# Altium schematic sheet Sheet1.SchDoc
size A4; SheetNumber: 1; SheetTotal: 1
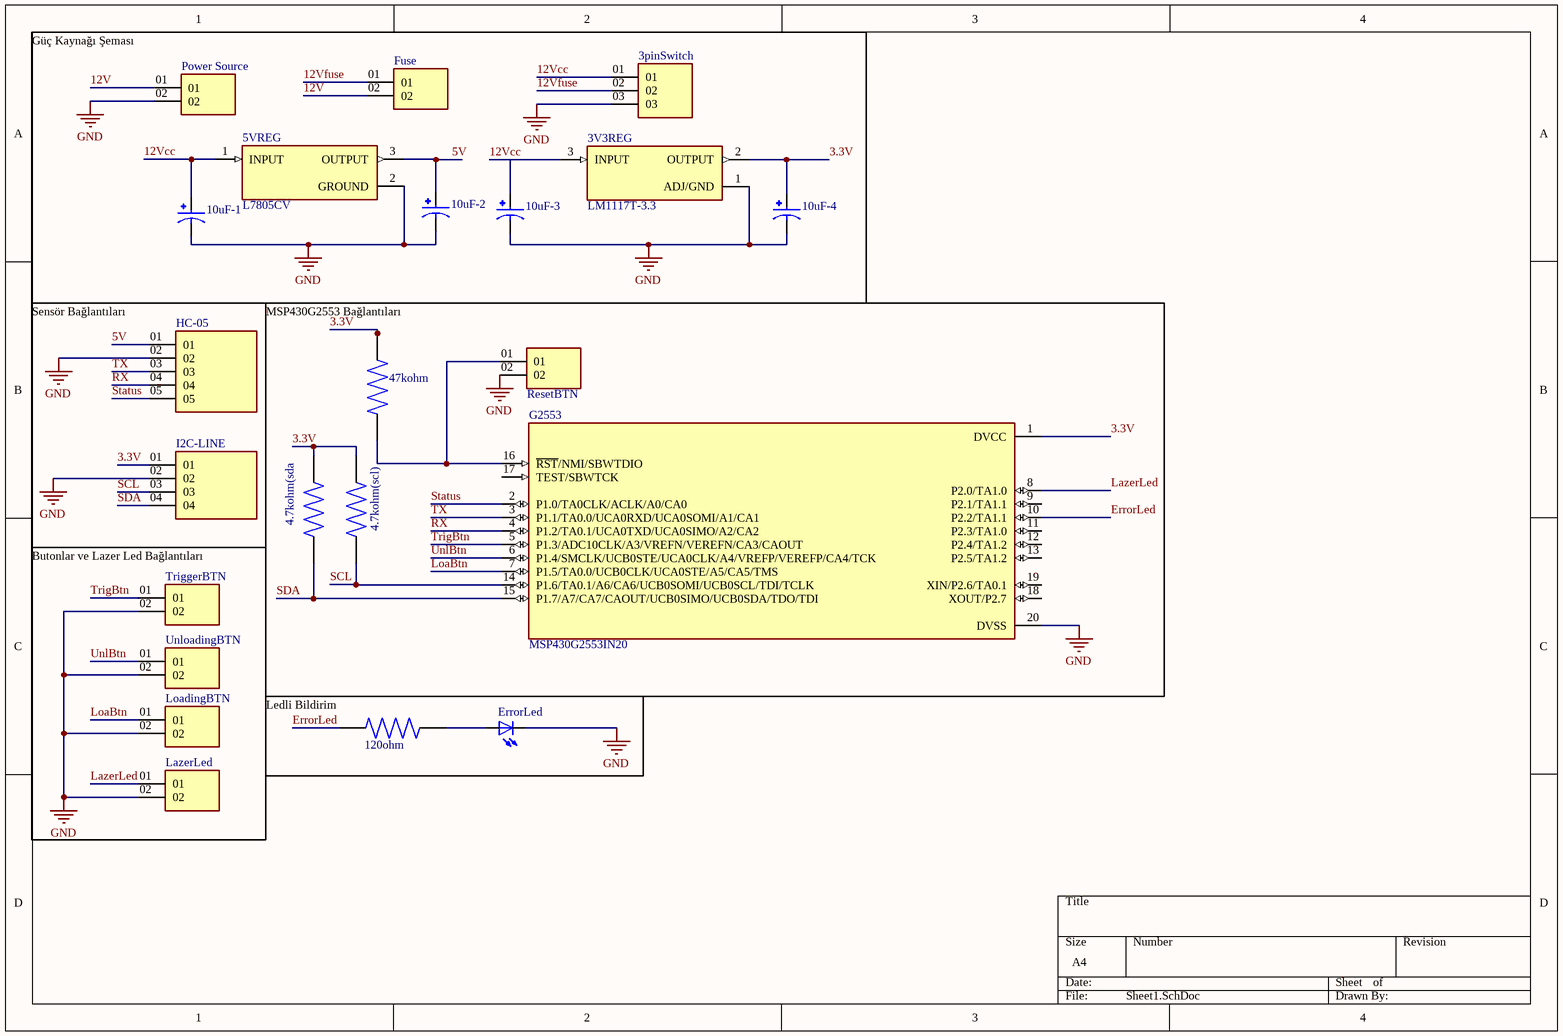
[diagram p0: Sheet1.SchDoc]

## Parts
3pinSwitch  FWJ-03-01-T-S  [SAMTEC_FWJ-03-01-T-S]  (value not drawn)
3V3REG  LM1117T-3.3  [TO254P1054X470X1955-3]
4.7kohm(scl)  RNC55H2941FSB14  [RESAD1081W64L635D269]  (value not drawn)
4.7kohm(sda  RNC55H2941FSB14  [RESAD1081W64L635D269]  (value not drawn)
5VREG  L7805CV  [TO255P1040X460X1968-3]
10uF-1  EEUFC1V221E  [CAPPRD500W60D1000H1250]  (value not drawn)
10uF-2  EEUFC1V221E  [CAPPRD500W60D1000H1250]  (value not drawn)
10uF-3  EEUFC1V221E  [CAPPRD500W60D1000H1250]  (value not drawn)
10uF-4  EEUFC1V221E  [CAPPRD500W60D1000H1250]  (value not drawn)
47kohm  RNC55H2941FSB14  [RESAD1081W64L635D269]  (value not drawn)
120ohm  RNC55H2941FSB14  [RESAD1081W64L635D269]  (value not drawn)
ErrorLed  TLLR4400  [LED3MM]  (value not drawn)
Fuse  FWJ-02-01-T-S  [SAMTEC_FWJ-02-01-T-S]  (value not drawn)
G2553  MSP430G2553IN20  [DIP794W45P254L2540H508Q20]
HC-05  TSW-105-23-L-S  [SAMTEC_TSW-105-23-L-S]  (value not drawn)
I2C-LINE  TSW-104-24-G-S  [SAMTEC_TSW-104-24-G-S]  (value not drawn)
LazerLed  FWJ-02-01-T-S  [SAMTEC_FWJ-02-01-T-S]  (value not drawn)
LoadingBTN  FWJ-02-01-T-S  [SAMTEC_FWJ-02-01-T-S]  (value not drawn)
Power_Source  FWJ-02-01-T-S  [SAMTEC_FWJ-02-01-T-S]  (value not drawn)
ResetBTN  FWJ-02-01-T-S  [SAMTEC_FWJ-02-01-T-S]  (value not drawn)
TriggerBTN  FWJ-02-01-T-S  [SAMTEC_FWJ-02-01-T-S]  (value not drawn)
UnloadingBTN  FWJ-02-01-T-S  [SAMTEC_FWJ-02-01-T-S]  (value not drawn)

## Nets
GND: 3pinSwitch.03 3V3REG.1(ADJ/GND) 5VREG.2(GROUND) 10uF-1.N 10uF-2.N 10uF-3.N 10uF-4.N ErrorLed.K(C) G2553.20(DVSS) HC-05.02 I2C-LINE.02 LazerLed.02 LoadingBTN.02 Power_Source.02 ResetBTN.02 TriggerBTN.02 UnloadingBTN.02
3.3V: 3V3REG.2(OUTPUT) 4.7kohm(scl).2 4.7kohm(sda.1 10uF-4.P 47kohm.1 G2553.1(DVCC) I2C-LINE.01
5V: 5VREG.3(OUTPUT) 10uF-2.P HC-05.01
12V: Fuse.02 Power_Source.01
12Vcc: 3pinSwitch.01 3V3REG.3(INPUT) 5VREG.1(INPUT) 10uF-1.P 10uF-3.P
12Vfuse: 3pinSwitch.02 Fuse.01
ErrorLed: 120ohm.1 G2553.10(P2.2/TA1.1)
LazerLed: G2553.8(P2.0/TA1.0) LazerLed.01
LoaBtn: G2553.7(P1.5/TA0.0/UCB0CLK/UCA0STE/A5/CA5/TMS) LoadingBTN.01
RX: G2553.4(P1.2/TA0.1/UCA0TXD/UCA0SIMO/A2/CA2) HC-05.04
SCL: 4.7kohm(scl).1 G2553.14(P1.6/TA0.1/A6/CA6/UCB0SOMI/UCB0SCL/TDI/TCLK) I2C-LINE.03
SDA: 4.7kohm(sda.2 G2553.15(P1.7/A7/CA7/CAOUT/UCB0SIMO/UCB0SDA/TDO/TDI) I2C-LINE.04
Status: G2553.2(P1.0/TA0CLK/ACLK/A0/CA0) HC-05.05
TrigBtn: G2553.5(P1.3/ADC10CLK/A3/VREFN/VEREFN/CA3/CAOUT) TriggerBTN.01
TX: G2553.3(P1.1/TA0.0/UCA0RXD/UCA0SOMI/A1/CA1) HC-05.03
UnlBtn: G2553.6(P1.4/SMCLK/UCB0STE/UCA0CLK/A4/VREFP/VEREFP/CA4/TCK) UnloadingBTN.01
Net47kohm_2: 47kohm.2 G2553.16(~{RST}/NMI/SBWTDIO) ResetBTN.01
Net120ohm_2: 120ohm.2 ErrorLed.A

Not connected (* = marked no-connect by the designer): G2553 9(P2.1/TA1.1) 11(P2.3/TA1.0) 12(P2.4/TA1.2) 13(P2.5/TA1.2) 17(TEST/SBWTCK) 18(XOUT/P2.7) 19(XIN/P2.6/TA0.1)

## Notes on the sheet
- Güç Kaynağı Şeması
- Sensör Bağlantıları
- MSP430G2553 Bağlantıları
- Ledli Bildirim
- Butonlar ve Lazer Led Bağlantıları

## Library data of the parts
3pinSwitch = FWJ-03-01-T-S: Connector Header Through Hole 3 position 0.156 (3.96mm); MF: Samtec; Availability: Bad; MP: FWJ-03-01-T-S; SnapEDA_Link: https://www.snapeda.com/parts/FWJ-03-01-T-S/Samtec/view-part/3298631/?ref=snap; Value: *; Price: None; Toby_UK-Purchase-URL: https://snapeda.com/shop?store=Toby+UK&id=3298631; Package: None
3V3REG = LM1117T-3.3/NOPB: 800-mA 15-V linear voltage regulator; MF: Texas Instruments; Package: TO-220-3 Texas Instruments; Price: None; Check_prices: https://www.snapeda.com/parts/LM1117T-3.3/NOPB/Texas+Instruments/view-part/?ref=eda; Value: *; SnapEDA_Link: https://www.snapeda.com/parts/LM1117T-3.3/NOPB/Texas+Instruments/view-part/?ref=snap; MP: LM1117T-3.3/NOPB; Availability: In Stock; Purchase-URL: https://pricing.snapeda.com/search/part/LM1117T-3.3/NOPB/?ref=eda
4.7kohm(scl) 4.7kohm(sda 47kohm 120ohm = RNC55H2941FSB14: Resistor,Metal Film,ERC-55 2.94K 1% T-2 RNC55H2941FS B14 | Vishay Dale RNC55H2941FSB14; SnapEDA_Link: https://www.snapeda.com/parts/RNC55H2941FSB14/Vishay/view-part/?ref=snap; Package: erc55 Vishay; Value: *; MF: Vishay; MP: RNC55H2941FSB14; Check_prices: https://www.snapeda.com/parts/RNC55H2941FSB14/Vishay/view-part/?ref=eda
5VREG = L7805CV: Linear Voltage Regulator IC Positive Fixed 1 Output 1.5A TO-220; MF: STMicroelectronics; SnapEDA_Link: https://www.snapeda.com/parts/L7805CV/STMicroelectronics/view-part/?ref=snap; Package: TO-220-3 ON Semiconductor; MP: L7805CV; Check_prices: https://www.snapeda.com/parts/L7805CV/STMicroelectronics/view-part/?ref=eda; Purchase-URL: https://pricing.snapeda.com/search/part/L7805CV/?ref=eda; Price: None; Value: *; Availability: In Stock
10uF-1-10uF-4 = EEUFC1V221E: Aluminum Electrolytic Capacitors - Radial Leaded; MP: EEU-FC1V221E; MF: Panasonic; SnapEDA_Link: https://www.snapeda.com/parts/EEU-FC1V221E/Panasonic/view-part/6222388/?ref=snap; Availability: In Stock; Purchase-URL: https://pricing.snapeda.com/search/part/EEU-FC1V221E/?ref=eda; Check_prices: https://www.snapeda.com/parts/EEU-FC1V221E/Panasonic/view-part/6222388/?ref=eda; Package: RADIAL-2 Panasonic; Price: None; Value: *
ErrorLed = TLLR4400: Red 619nm LED Indication - Discrete 1.9V Radial; MF: Vishay; Package: Radial Vishay Semiconductor; Value: *; Price: None; MP: TLLR4400; Availability: Unavailable; SnapEDA_Link: https://www.snapeda.com/parts/TLLR4400/Vishay%20Semiconductor%20Opto%20Division/view-part/557946/?ref=snap
Fuse LazerLed LoadingBTN Power_Source ResetBTN TriggerBTN UnloadingBTN = FWJ-02-01-T-S: Connector Header Through Hole 2 position 0.156 (3.96mm); MF: Samtec; Check_prices: https://www.snapeda.com/parts/FWJ-02-01-T-S/Samtec/view-part/3368235/?ref=eda; Purchase-URL: https://pricing.snapeda.com/search/part/FWJ-02-01-T-S/?ref=eda; SnapEDA_Link: https://www.snapeda.com/parts/FWJ-02-01-T-S/Samtec/view-part/3368235/?ref=snap; Value: *; MP: FWJ-02-01-T-S; Package: None; Price: None; Availability: In Stock
G2553 = MSP430G2553IN20: 16 MHz MCU with 16KB Flash, 512B SRAM, comparator, UART/SPI/I2C, timer; MF: Texas Instruments; SnapEDA_Link: https://www.snapeda.com/parts/MSP430G2553IN20/Texas+Instruments/view-part/?ref=snap; Package: PDIP-20 Texas Instruments; Value: *; MP: MSP430G2553IN20; Check_prices: https://www.snapeda.com/parts/MSP430G2553IN20/Texas+Instruments/view-part/?ref=eda
HC-05 = TSW-105-23-L-S: Connector Header Through Hole 5 position 0.100 (2.54mm); MF: Samtec; Package: None; Value: *; SnapEDA_Link: https://www.snapeda.com/parts/TSW-105-23-L-S/Samtec/view-part/?ref=snap; Check_prices: https://www.snapeda.com/parts/TSW-105-23-L-S/Samtec/view-part/?ref=eda; Purchase-URL: https://pricing.snapeda.com/search/part/TSW-105-23-L-S/?ref=eda; MP: TSW-105-23-L-S; Digi-Key_Part_Number: SAM1071-05-ND
I2C-LINE = TSW-104-24-G-S: Connector Header Through Hole 4 position 0.100 (2.54mm); MF: Samtec; Price: None; Availability: Unavailable; Package: None; MP: TSW-104-24-G-S; Value: *; SnapEDA_Link: https://www.snapeda.com/parts/TSW-104-24-G-S/Samtec/view-part/3451889/?ref=snap